# Altium project Pyroboardv1.PrjPcb
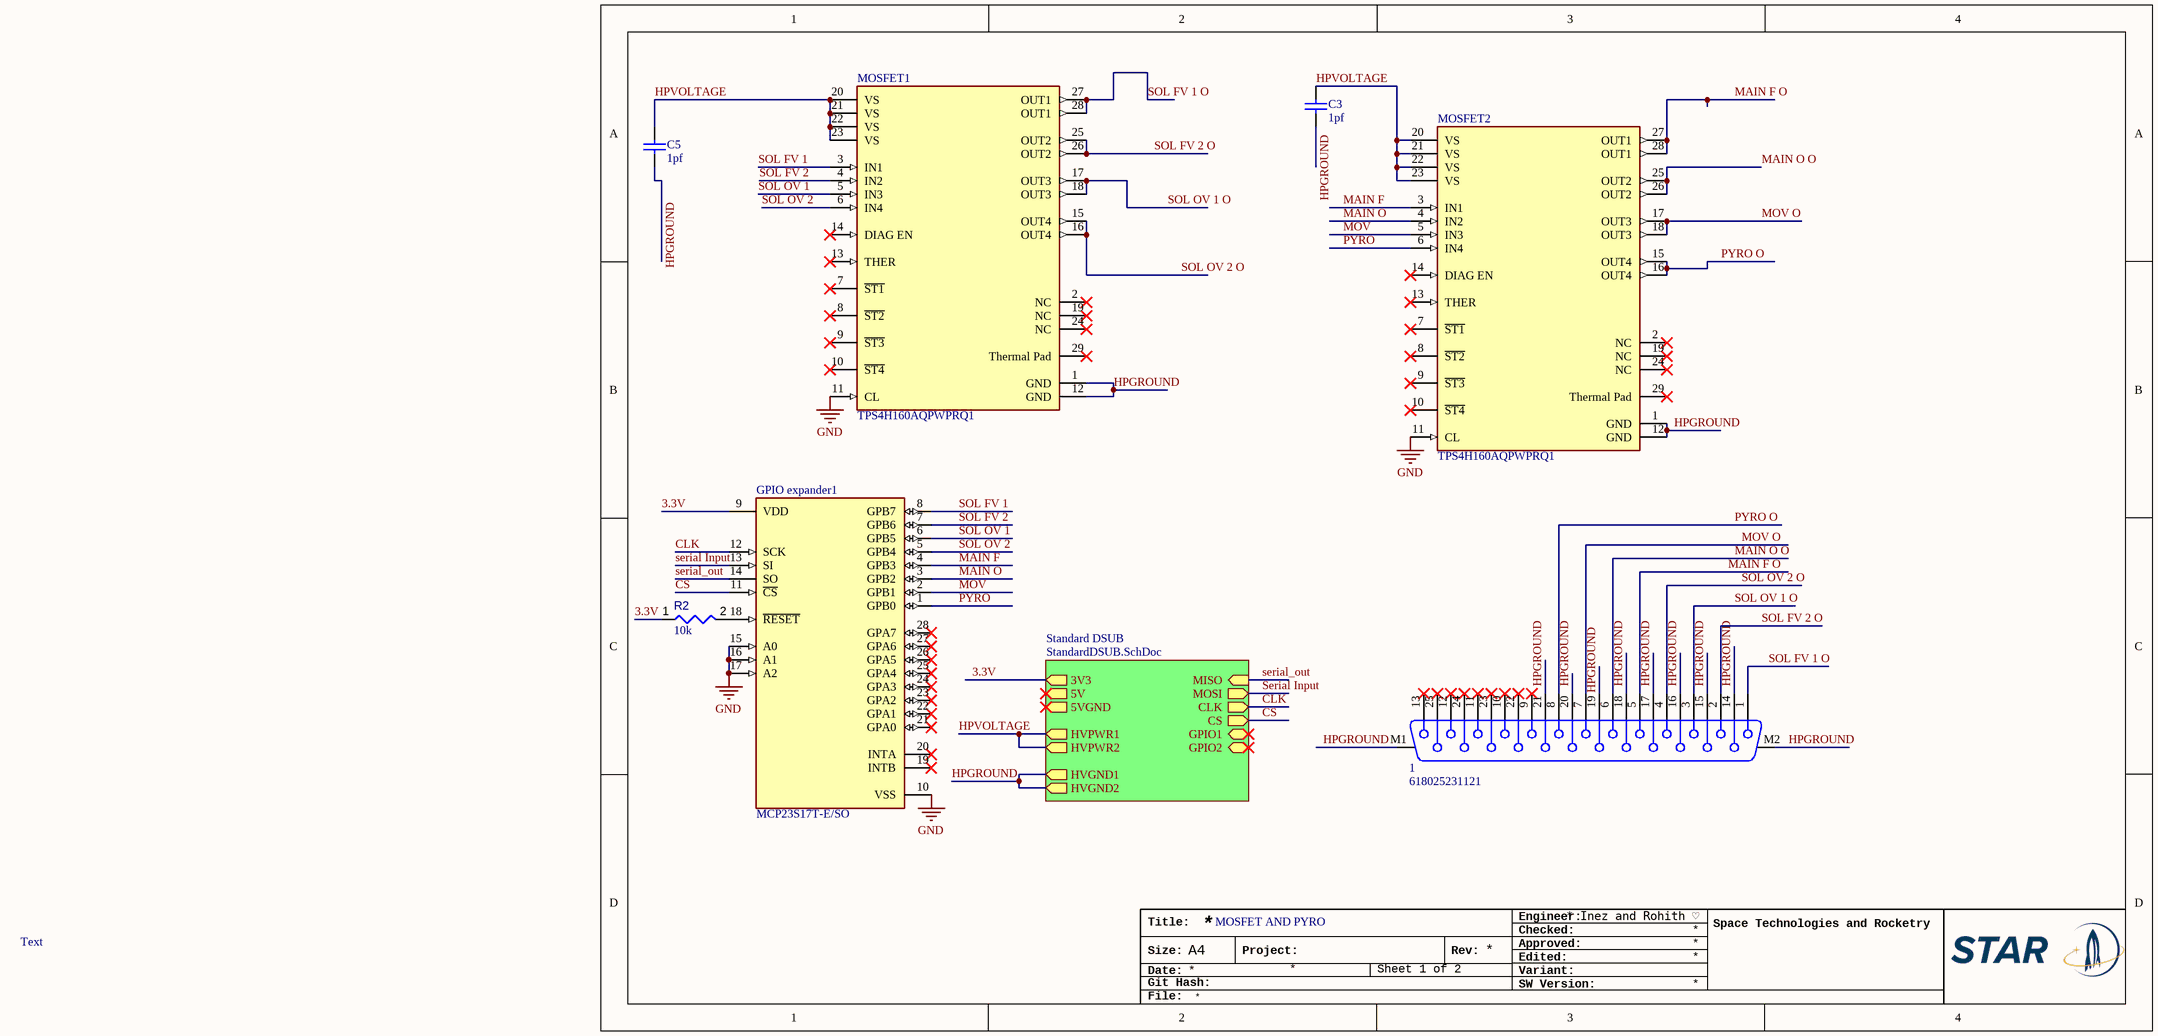
[diagram p0: Hotfire_1.SchDoc]
2 sheets, 28 parts. Net scope: hierarchical (ports join the sheet entries above them; power ports are global).
Board file: PCB1.PcbDoc
Sheets:
  Hotfire_1.SchDoc
    Standard DSUB = StandardDSUB.SchDoc

## Sheet Hotfire_1.SchDoc
size A4; Engineer: * Inez and Rohith ♡; SheetNumber: 1; SheetTotal: 2

### Parts
1  618025231121  [618025231121]
C3  1pf  [CAPC2013X140X50NL20T25]
C5  1pf  [CAPC2013X140X50NL20T25]
GPIO_expander1  MCP23S17T-E/SO  [FP-C04-052-IPC_A]
MOSFET1  TPS4H160AQPWPRQ1  [FP-PWP0028C-IPC_B]
MOSFET2  TPS4H160AQPWPRQ1  [FP-PWP0028C-IPC_B]
R2  value 10k  [RESC1608X55X25ML10T15]  (hidden comment: Resistor 10k +/-1% 0603 100 mW)

### Sub-sheets
Standard DSUB = StandardDSUB.SchDoc: GPIO1 (bidir), MISO (in), MOSI (out), CLK (out), CS (out), GPIO2 (bidir), 3V3 (out), 5V (out), 5VGND (out), HVPWR1 (out), HVPWR2 (out), HVGND1 (out), HVGND2 (out)

### Nets
GND: GPIO_expander1.10(VSS) GPIO_expander1.15(A0) GPIO_expander1.16(A1) GPIO_expander1.17(A2) MOSFET1.11(CL) MOSFET2.11(CL)  [project net 3V3GND]
3.3V: GPIO_expander1.9(VDD) R2.1 ; sheet Standard DSUB/3V3
CLK: GPIO_expander1.12(SCK) ; sheet Standard DSUB/CLK
CS: GPIO_expander1.11(~{CS}) ; sheet Standard DSUB/CS
HPGROUND: 1.14 1.15 1.16 1.17 1.18 1.19 1.20 1.21 1.M1 1.M2 C3.2 C5.2 MOSFET1.1(GND) MOSFET1.12(GND) MOSFET2.1(GND) MOSFET2.12(GND) ; sheet Standard DSUB/HVGND1, sheet Standard DSUB/HVGND2
HPVOLTAGE: C3.1 C5.1 MOSFET1.20(VS) MOSFET1.21(VS) MOSFET1.22(VS) MOSFET1.23(VS) MOSFET2.20(VS) MOSFET2.21(VS) MOSFET2.22(VS) MOSFET2.23(VS) ; sheet Standard DSUB/HVPWR1, sheet Standard DSUB/HVPWR2
MAIN F: GPIO_expander1.4(GPB3) MOSFET2.3(IN1)
MAIN F O: 1.5 MOSFET2.27(OUT1) MOSFET2.28(OUT1)
MAIN O: GPIO_expander1.3(GPB2) MOSFET2.4(IN2)
MAIN O O: 1.6 MOSFET2.25(OUT2) MOSFET2.26(OUT2)
MOV: GPIO_expander1.2(GPB1) MOSFET2.5(IN3)
MOV O: 1.7 MOSFET2.17(OUT3) MOSFET2.18(OUT3)
PYRO: GPIO_expander1.1(GPB0) MOSFET2.6(IN4)
PYRO O: 1.8 MOSFET2.15(OUT4) MOSFET2.16(OUT4)
Serial Input: GPIO_expander1.13(SI) ; sheet Standard DSUB/MOSI  [project net MOSI]
serial_out: GPIO_expander1.14(SO) ; sheet Standard DSUB/MISO  [project net MISO]
SOL FV 1: GPIO_expander1.8(GPB7) MOSFET1.3(IN1)
SOL FV 1 O: 1.1 MOSFET1.27(OUT1) MOSFET1.28(OUT1)
SOL FV 2: GPIO_expander1.7(GPB6) MOSFET1.4(IN2)
SOL FV 2 O: 1.2 MOSFET1.25(OUT2) MOSFET1.26(OUT2)
SOL OV 1: GPIO_expander1.6(GPB5) MOSFET1.5(IN3)
SOL OV 1 O: 1.3 MOSFET1.17(OUT3) MOSFET1.18(OUT3)
SOL OV 2: GPIO_expander1.5(GPB4) MOSFET1.6(IN4)
SOL OV 2 O: 1.4 MOSFET1.15(OUT4) MOSFET1.16(OUT4)
NetGPIO_expander1_18: GPIO_expander1.18(~{RESET}) R2.2

Not connected (* = marked no-connect by the designer): 1 9* 10* 11* 12* 13* 22* 23* 24* 25*; GPIO_expander1 19(INTB)* 20(INTA)* 21(GPA0)* 22(GPA1)* 23(GPA2)* 24(GPA3)* 25(GPA4)* 26(GPA5)* 27(GPA6)* 28(GPA7)*; MOSFET1 2(NC)* 7(~{ST1})* 8(~{ST2})* 9(~{ST3})* 10(~{ST4})* 13(THER)* 14(DIAG_EN)* 19(NC)* 24(NC)* 29(Thermal_Pad)*; MOSFET2 2(NC)* 7(~{ST1})* 8(~{ST2})* 9(~{ST3})* 10(~{ST4})* 13(THER)* 14(DIAG_EN)* 19(NC)* 24(NC)* 29(Thermal_Pad)*

### Notes on the sheet
- MOSFET AND PYRO
- Text
- Title:
- Engineer:
- Checked:
- Space Technologies and Rocketry
- Size:
- Date:
- Git Hash:
- A4
- Project:
- Rev:
- SW Version:
- Variant:
- Edited:
- Approved:
- File:

### Library data of the parts
1 = CMP-1502-00202-2: NexarPartId: 18818207; Pitch: 2.77mm; Operating Supply Voltage: 125V; Gender: Female; Insulation Resistance: 5GΩ; Contact Resistance: 30mΩ; Current Rating: 3A; Number of Contacts: 25; Contact Plating: Gold; Width: 12.5mm; RoHS: Compliant; REACH SVHC: Unknown; Min Operating Temperature: -55°C; Termination: SMD/SMT; Voltage Rating: 125V; Mount: Through Hole; Housing Material: Steel; Insulation Material: PBT; Number of Rows: 2; Depth: 18.5mm; Orientation: Right Angle; Number of Pins: 25; Max Operating Temperature: 105°C; Length: 38.33mm
C3 C5 = CMP-2007-04531-1: Manufacturer: AVX Interconnect / Elco; Part Number: 08051A181FAT2A
GPIO_expander1 = CMP-0186-00131-3: IC I/O EXPANDER SPI 16B 28SOIC; Power Dissipation: 700mW; Nominal Supply Current: 1mA; Frequency: 10MHz; Min Supply Voltage: 4.5V; Number of Bits: 16; Max Supply Voltage: 5.5V; Number of Channels: 1; Package Quantity: 1600; Min Operating Temperature: -40°C; Mount: Surface Mount; Lead Free: Lead Free; REACH SVHC: No SVHC; Packaging: Tape and Reel; Interface: SPI; Max Operating Temperature: 125°C; Case/Package: SOIC; Number of Pins: 28; Number of I/Os: 16; Max Frequency: 10MHz
MOSFET1 MOSFET2 = CMP-019-00059-1: Buffer/Inverter Based Peripheral Driver, 2.5A, PDSO28; Min Supply Voltage: 4V; Max Supply Voltage: 40V; Min Operating Temperature: -40°C; Pins: 28; RoHS Compliant: Yes; Case/Package: TSSOP; Max Operating Temperature: 125°C
R2 = CMP-009-00017-5: Chip Resistor, 10 KOhm, +/- 1%, 01 W, -55 to 155 degC, 0603 (1608 Metric); Voltage Rating: 50V; Power: 100mW; RoHS Compliant: True; Min Operating Temperature: -55°C; Pins: 2; Case/Package: 0603; Mounting Technology: SM; Max Operating Temperature: 155°C; Tolerance: 1%

## Sheet StandardDSUB.SchDoc
size A; SheetNumber: 2; SheetTotal: 2
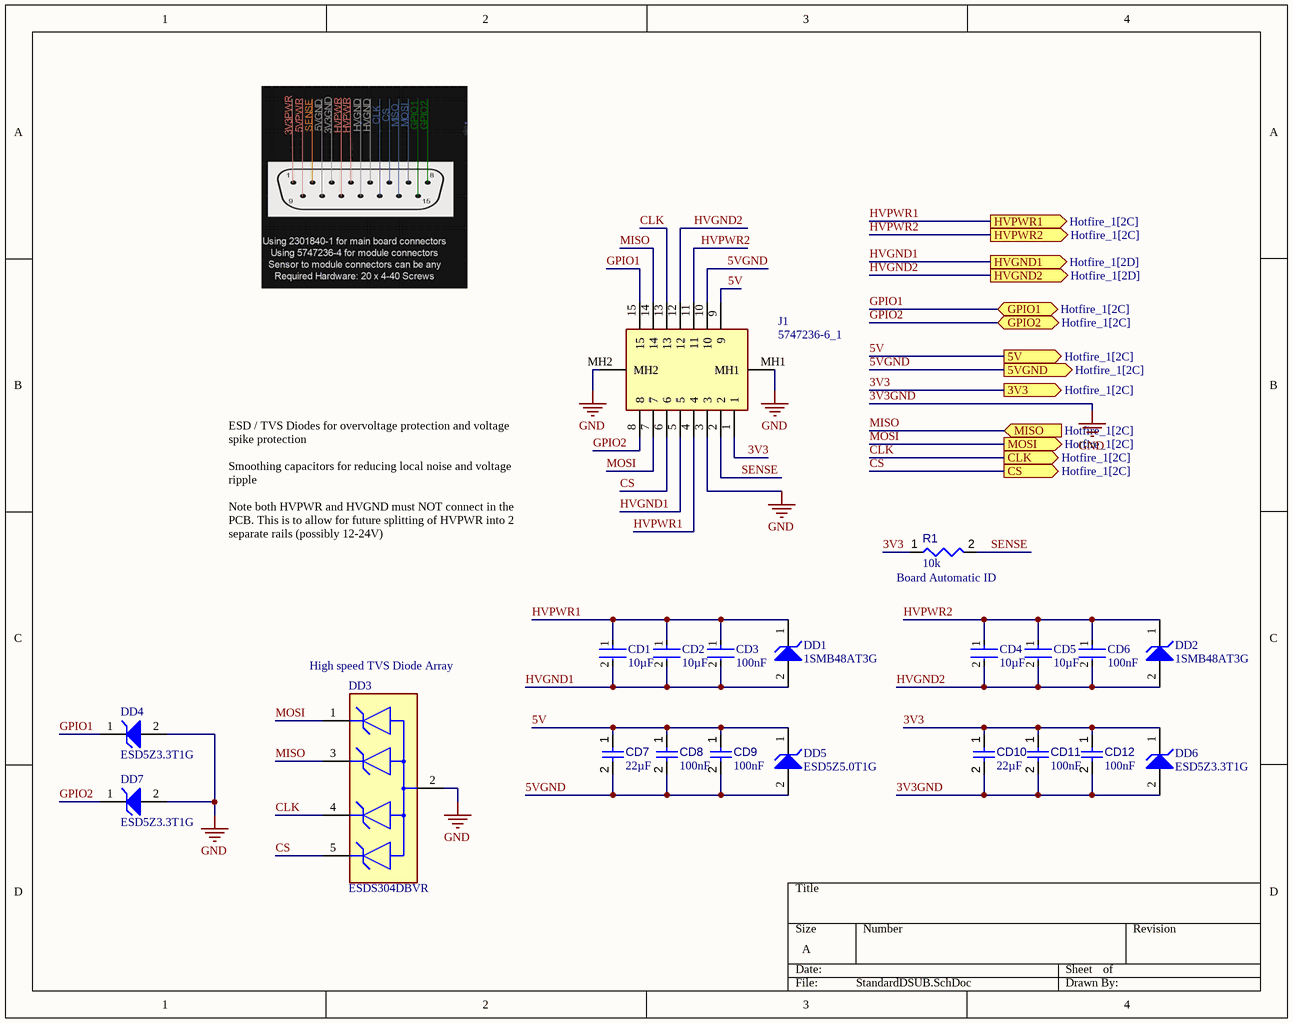
[diagram p1: StandardDSUB.SchDoc]

### Parts
CD1  value 10µF  [FP-CL32-IPC_B]  (hidden comment: CL32B106KMVNNWE)
CD2  value 10µF  [FP-CL32-IPC_B]  (hidden comment: CL32B106KMVNNWE)
CD3  value 100nF  [FP-CL10-IPC_B]  (hidden comment: CL10B104KC8NNNC)
CD4  value 10µF  [FP-CL32-IPC_B]  (hidden comment: CL32B106KMVNNWE)
CD5  value 10µF  [FP-CL32-IPC_B]  (hidden comment: CL32B106KMVNNWE)
CD6  value 100nF  [FP-CL10-IPC_B]  (hidden comment: CL10B104KC8NNNC)
CD7  value 22µF  [CAPC0805(2012)145_L]  (hidden comment: Capacitor 22µF +/-40% 16V 0805)
CD8  value 100nF  [CAPC2013X95X50LL10T25]  (hidden comment: Capacitor 100 nF +/-10% 50 V 0805)
CD9  value 100nF  [CAPC2013X95X50LL10T25]  (hidden comment: Capacitor 100 nF +/-10% 50 V 0805)
CD10  value 22µF  [CAPC0805(2012)145_L]  (hidden comment: Capacitor 22µF +/-40% 16V 0805)
CD11  value 100nF  [CAPC2013X95X50LL10T25]  (hidden comment: Capacitor 100 nF +/-10% 50 V 0805)
CD12  value 100nF  [CAPC2013X95X50LL10T25]  (hidden comment: Capacitor 100 nF +/-10% 50 V 0805)
DD1  1SMB48AT3G  [ONSC-SMB-2-403A-03_H_V]
DD2  1SMB48AT3G  [ONSC-SMB-2-403A-03_H_V]
DD3  ESDS304DBVR  [FP-DBV0005A-IPC_B]
DD4  ESD5Z3.3T1G  [ONSC-SOD-523-2-502-01_V]
DD5  ESD5Z5.0T1G  [ONSC-SOD-523-2-502-01_V]
DD6  ESD5Z3.3T1G  [ONSC-SOD-523-2-502-01_V]
DD7  ESD5Z3.3T1G  [ONSC-SOD-523-2-502-01_V]
J1  5747236-6_1  [57472366]
R1  value 10k  [RESC2013X50X35ML15T15]  (hidden comment: Resistor 10k +/-1% 0805 125 mW)

### Ports
3V3 (out, see Hotfire_1[2C]), 5V (out, see Hotfire_1[2C]), 5VGND (out, see Hotfire_1[2C]), CLK (out, see Hotfire_1[2C]), CS (out, see Hotfire_1[2C]), GPIO1 (bidir, see Hotfire_1[2C]), GPIO2 (bidir, see Hotfire_1[2C]), HVGND1 (out, see Hotfire_1[2D]), HVGND2 (out, see Hotfire_1[2D]), HVPWR1 (out, see Hotfire_1[2C]), HVPWR2 (out, see Hotfire_1[2C]), MISO (in, see Hotfire_1[2C]), MOSI (out, see Hotfire_1[2C])

### Nets
3V3GND: CD10.2 CD11.2 CD12.2 DD3.2(GND) DD4.2(A) DD6.2(A) DD7.2(A) J1.3 J1.MH1 J1.MH2  [also labelled GND]
3V3: CD10.1 CD11.1 CD12.1 DD6.1(K) J1.1 R1.1 ; port 3V3  [project net 3.3V]
5V: CD7.1 CD8.1 CD9.1 DD5.1(K) J1.9 ; port 5V
5VGND: CD7.2 CD8.2 CD9.2 DD5.2(A) J1.10 ; port 5VGND
CLK: DD3.4(I/O3) J1.13 ; port CLK
CS: DD3.5(I/O4) J1.6 ; port CS
GPIO1: DD4.1(K) J1.15 ; port GPIO1
GPIO2: DD7.1(K) J1.8 ; port GPIO2
HVGND1: CD1.2 CD2.2 CD3.2 CD4.2 CD5.2 CD6.2 DD1.2(A) DD2.2(A) J1.5 J1.12 ; port HVGND1, port HVGND2  [also labelled HVGND2]  [project net HPGROUND]
HVPWR1: CD1.1 CD2.1 CD3.1 CD4.1 CD5.1 CD6.1 DD1.1(K) DD2.1(K) J1.4 J1.11 ; port HVPWR1, port HVPWR2  [also labelled HVPWR2]  [project net HPVOLTAGE]
MISO: DD3.3(I/O2) J1.14 ; port MISO
MOSI: DD3.1(I/O1) J1.7 ; port MOSI
SENSE: J1.2 R1.2

### Notes on the sheet
- ESD / TVS Diodes for overvoltage protection and voltage spike protection
  Smoothing capacitors for reducing local noise and voltage ripple
  Note both HVPWR and HVGND must NOT connect in the PCB. This is to allow for future splitting of HVPWR into 2 separate rails (possibly 12-24V)
- (near R1) Board Automatic ID
- (near DD3) High speed TVS Diode Array

### Library data of the parts
CD1 CD2 CD4 CD5 = CMP-001-00107-1: Ceramic Capacitor, Multilayer, Ceramic, 63V, 10% +Tol, 10% -Tol, X7R, 15% TC, 10uF, Surface Mount, 1210; Max Operating Temperature: 125°C; RoHS Compliant: Yes; Case/Package: 1210; Mounting Technology: Surface Mount; Capacitor Type: Ceramic; Pins: 2; Min Operating Temperature: -55°C
CD3 CD6 = CMP-001-00108-1: Ceramic Capacitor, Multilayer, Ceramic, 100V, 10% +Tol, 10% -Tol, X7R, 15% TC, 0.1uF, Surface Mount, 0603; Mounting Technology: Surface Mount; Max Operating Temperature: 125°C; Case/Package: 0603; Capacitor Type: Ceramic; Pins: 2; Min Operating Temperature: -55°C; RoHS Compliant: Yes
CD7 CD10 = CMP-001-00081-4: Chip Capacitor, 22µF +/-40%, 16V, 0805, Thickness 1.45 mm; Tolerance: 5%; Voltage Rating: 16V; Mounting Technology: SMT; Pins: 2; Max Operating Temperature: 85°C; Case/Package: 0805; Min Operating Temperature: -55°C
CD8 CD9 CD11 CD12 = CMP-001-00018-6: Chip Capacitor, 100 nF, +/- 10%, 50 V, 0805 (2012 Metric); Capacitor Type: Ceramic; Voltage Rating: 50V; Pins: 2; Max Operating Temperature: 125°C; Min Operating Temperature: -55°C; Mounting Technology: SM; Case/Package: 0805; RoHS Compliant: True; Tolerance: 10%
DD1 DD2 = CMP-004-00036-1: Trans Voltage Suppressor Diode, 600W, 48V V(RWM), Unidirectional, 1 Element, Silicon, DO-214AA; RoHS Compliant: Yes; Pins: 2; Min Operating Temperature: -65°C; Max Operating Temperature: 150°C
DD3 = CMP-004-00037-1: Trans Voltage Suppressor Diode, 85W, 3.6V V(RWM), Unidirectional, 4 Element, Silicon; RoHS Compliant: Yes
DD4 DD6 DD7 = CMP-004-00034-1: Trans Voltage Suppressor Diode, 158W, 3.3V V(RWM), Unidirectional, 1 Element, Silicon; Min Operating Temperature: -55°C; RoHS Compliant: Yes; Pins: 2; Max Operating Temperature: 150°C
DD5 = CMP-004-00035-1: Trans Voltage Suppressor Diode, 240W, 5V V(RWM), Unidirectional, 1 Element, Silicon; Max Operating Temperature: 150°C; Min Operating Temperature: -55°C; RoHS Compliant: Yes; Pins: 2
J1 = CMP-031-000002-4: Male 15 pin DSUB, Used for Hotfire Modules - can connect to Hotfire main board; Manufacturer_Name: TE Connectivity; Source: SamacSys.SchLib; Height: 12.93mm; Arrow Price/Stock: https://www.arrow.com/en/products/5747236-6/te-connectivity; Mouser Price/Stock: https://www.mouser.co.uk/ProductDetail/TE-Connectivity/5747236-6?qs=2De2tSDgB03zVLI%252B5IT1Bw%3D%3D; Mouser Part Number: 571-5747236-6; Manufacturer_Part_Number: 5747236-6; Design Item ID: 5747236-6_1; Datasheet Link: https://www.te.com/commerce/DocumentDelivery/DDEController?Action=srchrtrv&DocNm=82068_AMPLIMITE_Right-Angle_Posted_Conn&DocType=Catalog%20Section&DocLang=English&PartCntxt=5747236-6&DocFormat=pdf; Arrow Part Number: 5747236-6
R1 = CMP-009-00018-5: Chip Resistor, 10 KOhm, +/- 1%, 125 mW, -55 to 155 degC, 0805 (2012 Metric); Power: 125mW; Voltage Rating: 150V; Tolerance: 1%; Pins: 2; Min Operating Temperature: -55°C; Case/Package: 0805; Max Operating Temperature: 155°C; RoHS Compliant: True; Mounting Technology: SM

## Nets that join several sheets
3V3GND: Hotfire_1 (6 pins), StandardDSUB (10 pins)
3.3V: Hotfire_1 (GPIO_expander1.9 R2.1), StandardDSUB (6 pins)
CLK: Hotfire_1 (GPIO_expander1.12), StandardDSUB (DD3.4 J1.13)
CS: Hotfire_1 (GPIO_expander1.11), StandardDSUB (DD3.5 J1.6)
HPGROUND: Hotfire_1 (16 pins), StandardDSUB (10 pins)
HPVOLTAGE: Hotfire_1 (10 pins), StandardDSUB (10 pins)
MISO: Hotfire_1 (GPIO_expander1.14), StandardDSUB (DD3.3 J1.14)
MOSI: Hotfire_1 (GPIO_expander1.13), StandardDSUB (DD3.1 J1.7)